# Altium schematic sheet 10_DDR2.SchDoc: RAM DDR2
size A3; Organization: Lime Microsystems; Address1: Surrey Tech Centre; Address2: Guildford GU2 7YG; Address3: Surray; Address4: United Kingdom; Revision: v1.2; SheetNumber: 10; SheetTotal: 14
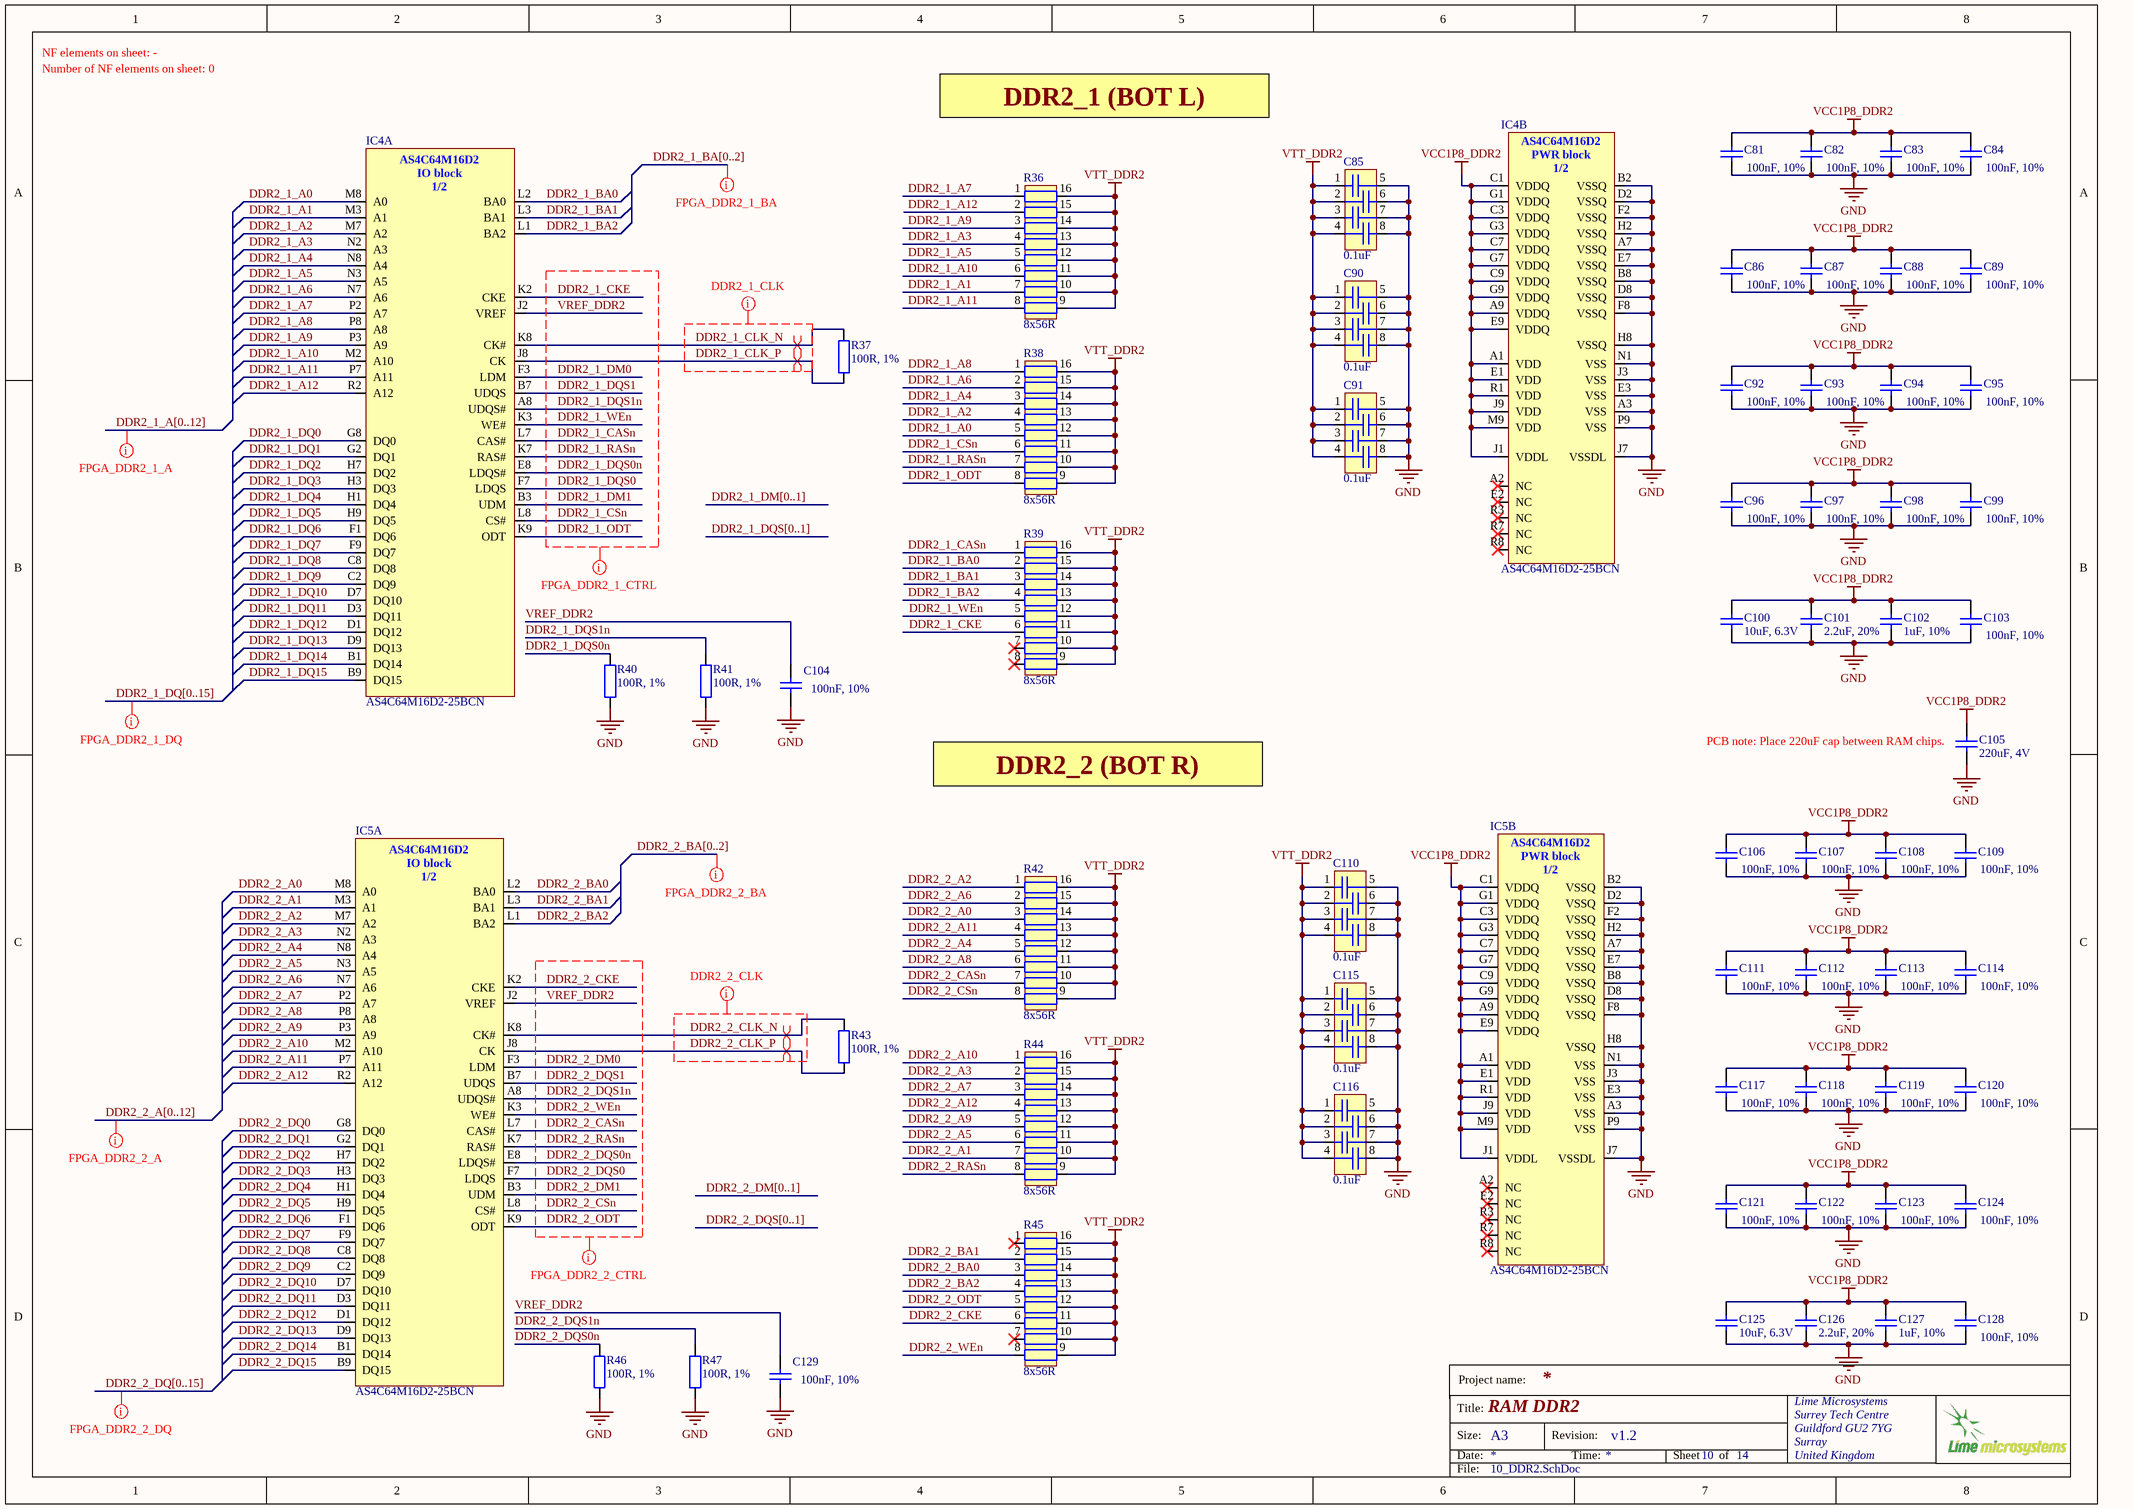
[diagram p0: 10_DDR2.SchDoc]

## Parts
C81  100nF, 10%  [CAP0402]
C82  100nF, 10%  [CAP0402]
C83  100nF, 10%  [CAP0402]
C84  100nF, 10%  [CAP0402]
C85  0.1uF  [CKCA43X7R1C104M100AA]
C86  100nF, 10%  [CAP0402]
C87  100nF, 10%  [CAP0402]
C88  100nF, 10%  [CAP0402]
C89  100nF, 10%  [CAP0402]
C90  0.1uF  [CKCA43X7R1C104M100AA]
C91  0.1uF  [CKCA43X7R1C104M100AA]
C92  100nF, 10%  [CAP0402]
C93  100nF, 10%  [CAP0402]
C94  100nF, 10%  [CAP0402]
C95  100nF, 10%  [CAP0402]
C96  100nF, 10%  [CAP0402]
C97  100nF, 10%  [CAP0402]
C98  100nF, 10%  [CAP0402]
C99  100nF, 10%  [CAP0402]
C100  10uF, 6.3V  [CAP0603]
C101  2.2uF, 20%  [CAP0402]
C102  1uF, 10%  [CAP0402]
C103  100nF, 10%  [CAP0402]
C104  100nF, 10%  [CAP0402]
C105  220uF, 4V  [CAP1206]
C106  100nF, 10%  [CAP0402]
C107  100nF, 10%  [CAP0402]
C108  100nF, 10%  [CAP0402]
C109  100nF, 10%  [CAP0402]
C110  0.1uF  [CKCA43X7R1C104M100AA]
C111  100nF, 10%  [CAP0402]
C112  100nF, 10%  [CAP0402]
C113  100nF, 10%  [CAP0402]
C114  100nF, 10%  [CAP0402]
C115  0.1uF  [CKCA43X7R1C104M100AA]
C116  0.1uF  [CKCA43X7R1C104M100AA]
C117  100nF, 10%  [CAP0402]
C118  100nF, 10%  [CAP0402]
C119  100nF, 10%  [CAP0402]
C120  100nF, 10%  [CAP0402]
C121  100nF, 10%  [CAP0402]
C122  100nF, 10%  [CAP0402]
C123  100nF, 10%  [CAP0402]
C124  100nF, 10%  [CAP0402]
C125  10uF, 6.3V  [CAP0603]
C126  2.2uF, 20%  [CAP0402]
C127  1uF, 10%  [CAP0402]
C128  100nF, 10%  [CAP0402]
C129  100nF, 10%  [CAP0402]
IC4  AS4C64M16D2-25BCN  [AS4C64M16D2]  (parts A,B of 2)
IC5  AS4C64M16D2-25BCN  [AS4C64M16D2]  (parts A,B of 2)
R36  8x56R  [EXB2HV]
R37  100R, 1%  [RES0402]
R38  8x56R  [EXB2HV]
R39  8x56R  [EXB2HV]
R40  100R, 1%  [RES0402]
R41  100R, 1%  [RES0402]
R42  8x56R  [EXB2HV]
R43  100R, 1%  [RES0402]
R44  8x56R  [EXB2HV]
R45  8x56R  [EXB2HV]
R46  100R, 1%  [RES0402]
R47  100R, 1%  [RES0402]

## Nets
GND: C81.2 C82.2 C83.2 C84.2 C85.5 C85.6 C85.7 C85.8 C86.2 C87.2 C88.2 C89.2 C90.5 C90.6 C90.7 C90.8 C91.5 C91.6 C91.7 C91.8 C92.2 C93.2 C94.2 C95.2 C96.2 C97.2 C98.2 C99.2 C100.1 C101.1 C102.1 C103.2 C104.2 C105.1 C106.2 C107.2 C108.2 C109.2 C110.5 C110.6 C110.7 C110.8 C111.2 C112.2 C113.2 C114.2 C115.5 C115.6 C115.7 C115.8 C116.5 C116.6 C116.7 C116.8 C117.2 C118.2 C119.2 C120.2 C121.2 C122.2 C123.2 C124.2 C125.1 C126.1 C127.1 C128.2 C129.2 IC4.A3(VSS) IC4.A7(VSSQ) IC4.B2(VSSQ) IC4.B8(VSSQ) IC4.D2(VSSQ) IC4.D8(VSSQ) IC4.E3(VSS) IC4.E7(VSSQ) IC4.F2(VSSQ) IC4.F8(VSSQ) IC4.H2(VSSQ) IC4.H8(VSSQ) IC4.J3(VSS) IC4.J7(VSSDL) IC4.N1(VSS) IC4.P9(VSS) IC5.A3(VSS) IC5.A7(VSSQ) IC5.B2(VSSQ) IC5.B8(VSSQ) IC5.D2(VSSQ) IC5.D8(VSSQ) IC5.E3(VSS) IC5.E7(VSSQ) IC5.F2(VSSQ) IC5.F8(VSSQ) IC5.H2(VSSQ) IC5.H8(VSSQ) IC5.J3(VSS) IC5.J7(VSSDL) IC5.N1(VSS) IC5.P9(VSS) R40.1 R41.1 R46.1 R47.1
VCC1P8_DDR2: C81.1 C82.1 C83.1 C84.1 C86.1 C87.1 C88.1 C89.1 C92.1 C93.1 C94.1 C95.1 C96.1 C97.1 C98.1 C99.1 C100.2 C101.2 C102.2 C103.1 C105.2 C106.1 C107.1 C108.1 C109.1 C111.1 C112.1 C113.1 C114.1 C117.1 C118.1 C119.1 C120.1 C121.1 C122.1 C123.1 C124.1 C125.2 C126.2 C127.2 C128.1 IC4.A1(VDD) IC4.A9(VDDQ) IC4.C1(VDDQ) IC4.C3(VDDQ) IC4.C7(VDDQ) IC4.C9(VDDQ) IC4.E1(VDD) IC4.E9(VDDQ) IC4.G1(VDDQ) IC4.G3(VDDQ) IC4.G7(VDDQ) IC4.G9(VDDQ) IC4.J1(VDDL) IC4.J9(VDD) IC4.M9(VDD) IC4.R1(VDD) IC5.A1(VDD) IC5.A9(VDDQ) IC5.C1(VDDQ) IC5.C3(VDDQ) IC5.C7(VDDQ) IC5.C9(VDDQ) IC5.E1(VDD) IC5.E9(VDDQ) IC5.G1(VDDQ) IC5.G3(VDDQ) IC5.G7(VDDQ) IC5.G9(VDDQ) IC5.J1(VDDL) IC5.J9(VDD) IC5.M9(VDD) IC5.R1(VDD)
VTT_DDR2: C85.1 C85.2 C85.3 C85.4 C90.1 C90.2 C90.3 C90.4 C91.1 C91.2 C91.3 C91.4 C110.1 C110.2 C110.3 C110.4 C115.1 C115.2 C115.3 C115.4 C116.1 C116.2 C116.3 C116.4 R36.9 R36.10 R36.11 R36.12 R36.13 R36.14 R36.15 R36.16 R38.9 R38.10 R38.11 R38.12 R38.13 R38.14 R38.15 R38.16 R39.9 R39.10 R39.11 R39.12 R39.13 R39.14 R39.15 R39.16 R42.9 R42.10 R42.11 R42.12 R42.13 R42.14 R42.15 R42.16 R44.9 R44.10 R44.11 R44.12 R44.13 R44.14 R44.15 R44.16 R45.9 R45.10 R45.11 R45.12 R45.13 R45.14 R45.15 R45.16
DDR2_1_A0: IC4.M8(A0) R38.5
DDR2_1_A1: IC4.M3(A1) R36.7
DDR2_1_A2: IC4.M7(A2) R38.4
DDR2_1_A3: IC4.N2(A3) R36.4
DDR2_1_A4: IC4.N8(A4) R38.3
DDR2_1_A5: IC4.N3(A5) R36.5
DDR2_1_A6: IC4.N7(A6) R38.2
DDR2_1_A7: IC4.P2(A7) R36.1
DDR2_1_A8: IC4.P8(A8) R38.1
DDR2_1_A9: IC4.P3(A9) R36.3
DDR2_1_A10: IC4.M2(A10) R36.6
DDR2_1_A11: IC4.P7(A11) R36.8
DDR2_1_A12: IC4.R2(A12) R36.2
DDR2_1_BA0: IC4.L2(BA0) R39.2
DDR2_1_BA1: IC4.L3(BA1) R39.3
DDR2_1_BA2: IC4.L1(BA2) R39.4
DDR2_1_CASn: IC4.L7(CAS#) R39.1
DDR2_1_CKE: IC4.K2(CKE) R39.6
DDR2_1_CLK_N: IC4.K8(CK#) R37.2
DDR2_1_CLK_P: IC4.J8(CK) R37.1
DDR2_1_CSn: IC4.L8(CS#) R38.6
DDR2_1_DM0: IC4.F3(LDM)
DDR2_1_DM1: IC4.B3(UDM)
DDR2_1_DQ0: IC4.G8(DQ0)
DDR2_1_DQ1: IC4.G2(DQ1)
DDR2_1_DQ2: IC4.H7(DQ2)
DDR2_1_DQ3: IC4.H3(DQ3)
DDR2_1_DQ4: IC4.H1(DQ4)
DDR2_1_DQ5: IC4.H9(DQ5)
DDR2_1_DQ6: IC4.F1(DQ6)
DDR2_1_DQ7: IC4.F9(DQ7)
DDR2_1_DQ8: IC4.C8(DQ8)
DDR2_1_DQ9: IC4.C2(DQ9)
DDR2_1_DQ10: IC4.D7(DQ10)
DDR2_1_DQ11: IC4.D3(DQ11)
DDR2_1_DQ12: IC4.D1(DQ12)
DDR2_1_DQ13: IC4.D9(DQ13)
DDR2_1_DQ14: IC4.B1(DQ14)
DDR2_1_DQ15: IC4.B9(DQ15)
DDR2_1_DQS0: IC4.F7(LDQS)
DDR2_1_DQS0n: IC4.E8(LDQS#) R40.2
DDR2_1_DQS1: IC4.B7(UDQS)
DDR2_1_DQS1n: IC4.A8(UDQS#) R41.2
DDR2_1_ODT: IC4.K9(ODT) R38.8
DDR2_1_RASn: IC4.K7(RAS#) R38.7
DDR2_1_WEn: IC4.K3(WE#) R39.5
DDR2_2_A0: IC5.M8(A0) R42.3
DDR2_2_A1: IC5.M3(A1) R44.7
DDR2_2_A2: IC5.M7(A2) R42.1
DDR2_2_A3: IC5.N2(A3) R44.2
DDR2_2_A4: IC5.N8(A4) R42.5
DDR2_2_A5: IC5.N3(A5) R44.6
DDR2_2_A6: IC5.N7(A6) R42.2
DDR2_2_A7: IC5.P2(A7) R44.3
DDR2_2_A8: IC5.P8(A8) R42.6
DDR2_2_A9: IC5.P3(A9) R44.5
DDR2_2_A10: IC5.M2(A10) R44.1
DDR2_2_A11: IC5.P7(A11) R42.4
DDR2_2_A12: IC5.R2(A12) R44.4
DDR2_2_BA0: IC5.L2(BA0) R45.3
DDR2_2_BA1: IC5.L3(BA1) R45.2
DDR2_2_BA2: IC5.L1(BA2) R45.4
DDR2_2_CASn: IC5.L7(CAS#) R42.7
DDR2_2_CKE: IC5.K2(CKE) R45.6
DDR2_2_CLK_N: IC5.K8(CK#) R43.2
DDR2_2_CLK_P: IC5.J8(CK) R43.1
DDR2_2_CSn: IC5.L8(CS#) R42.8
DDR2_2_DM0: IC5.F3(LDM)
DDR2_2_DM1: IC5.B3(UDM)
DDR2_2_DQ0: IC5.G8(DQ0)
DDR2_2_DQ1: IC5.G2(DQ1)
DDR2_2_DQ2: IC5.H7(DQ2)
DDR2_2_DQ3: IC5.H3(DQ3)
DDR2_2_DQ4: IC5.H1(DQ4)
DDR2_2_DQ5: IC5.H9(DQ5)
DDR2_2_DQ6: IC5.F1(DQ6)
DDR2_2_DQ7: IC5.F9(DQ7)
DDR2_2_DQ8: IC5.C8(DQ8)
DDR2_2_DQ9: IC5.C2(DQ9)
DDR2_2_DQ10: IC5.D7(DQ10)
DDR2_2_DQ11: IC5.D3(DQ11)
DDR2_2_DQ12: IC5.D1(DQ12)
DDR2_2_DQ13: IC5.D9(DQ13)
DDR2_2_DQ14: IC5.B1(DQ14)
DDR2_2_DQ15: IC5.B9(DQ15)
DDR2_2_DQS0: IC5.F7(LDQS)
DDR2_2_DQS0n: IC5.E8(LDQS#) R46.2
DDR2_2_DQS1: IC5.B7(UDQS)
DDR2_2_DQS1n: IC5.A8(UDQS#) R47.2
DDR2_2_ODT: IC5.K9(ODT) R45.5
DDR2_2_RASn: IC5.K7(RAS#) R44.8
DDR2_2_WEn: IC5.K3(WE#) R45.8
VREF_DDR2: C104.1 C129.1 IC4.J2(VREF) IC5.J2(VREF)

Not connected (* = marked no-connect by the designer): IC4 A2(NC)* E2(NC)* R3(NC)* R7(NC)* R8(NC)*; IC5 A2(NC)* E2(NC)* R3(NC)* R7(NC)* R8(NC)*; R39 7* 8*; R45 1* 7*

## Buses and harness runs
bus DDR2_1_A[0..12]
bus DDR2_1_BA[0..2]
bus DDR2_1_DM[0..1]
bus DDR2_1_DQ[0..15]
bus DDR2_1_DQS[0..1]
bus DDR2_2_A[0..12]
bus DDR2_2_BA[0..2]
bus DDR2_2_DM[0..1]
bus DDR2_2_DQ[0..15]
bus DDR2_2_DQS[0..1]

## Layout directives
net class FPGA_DDR0_DQ: (no net found under the mark)
net class FPGA_DDR0_BA: (no net found under the mark)
net class FPGA_DDR0_CTRL: DDR2_1_CASn, DDR2_1_CKE, DDR2_1_CSn, DDR2_1_DM0, DDR2_1_DM1, DDR2_1_DQS0, DDR2_1_DQS0n, DDR2_1_DQS1, DDR2_1_DQS1n, DDR2_1_ODT, DDR2_1_RASn, DDR2_1_WEn, VREF_DDR2
net class FPGA_DDR0_A: (no net found under the mark)
net class FPGA_DDR1_DQ: (no net found under the mark)
net class FPGA_DDR1_BA: (no net found under the mark)
net class FPGA_DDR1_CTRL: DDR2_2_CASn, DDR2_2_CKE, DDR2_2_CSn, DDR2_2_DM0, DDR2_2_DM1, DDR2_2_DQS0, DDR2_2_DQS0n, DDR2_2_DQS1, DDR2_2_DQS1n, DDR2_2_ODT, DDR2_2_RASn, DDR2_2_WEn, VREF_DDR2
net class FPGA_DDR1_A: (no net found under the mark)
differential pair: DDR2_1_CLK_N, DDR2_1_CLK_P, DDR2_2_CLK_N, DDR2_2_CLK_P
net class DDR2_1_CK: DDR2_1_CLK_N, DDR2_1_CLK_P, DDR2_2_CLK_N, DDR2_2_CLK_P

## Notes on the sheet
- Number of NF elements on sheet: 0
- NF elements on sheet: -
- DDR2_1 (BOT L)
- DDR2_2 (BOT R)
- (near C105) PCB note: Place 220uF cap between RAM chips.
- Project name:
- Title:
- Size:
- Date:
- A3
- Revision:
- Time:
- Sheet
- of
- File:
- (in symbol AS4C64M16D2-25BCN, part A) AS4C64M16D2 / IO block / 1/2
- (in symbol AS4C64M16D2-25BCN, part B) AS4C64M16D2 / PWR block / 1/2

## Library data of the parts
C81-C84 C86-C89 C92-C99 C103 C104 C106-C109 C111-C114 C117-C124 C128 C129 = Cap_0603: Manufacturer Part Number 1: GRM155R71C104KA88D; Part Description: 0.10µF ±10% 16V X7R Ceramic Capacitor -55°C ~ 125°C Surface Mount, MLCC 0402 (1005 Metric) 0.039" L x 0.020" W (1.00mm x 0.50mm); Brand: Murata Electronics; Type: General Purpose MLCC; Capacitance: 0.1 uF; Temperature Coefficient / Code: +/- 15 %; Voltage Rating DC: 16 V; Supplier 1: Mouser; Supplier Part Number 1: 81-GRM155R71C104KA88; Tolerance: 10 %; Case Code - in: 0402; Manufacturer: Murata Electronics; Category: Multilayer Ceramic Capacitors MLCC - SMD/SMT; Value: 100nF, 10%; Manufacturer Part Number: GRM155R71C104KA88D
C85 C90 C91 C110 C115 C116 = 4X_cap_array_1206: Manufacturer: TDK; Part Description: CAP ARRAY 0.1UF 16V X7R 1206; Case Height: 1 mm; Case Length: 3.2 mm; Case Width: 1.6 mm; Voltage Rating: 16 V; Number of Elements: 4; Tolerance: 20 %; Temperature Coefficient / Code: X7R; Value: 0.1uF; Supplier 1: Mouser; Supplier Part Number 1: 810-CKCA43X7R1C104M; RoHS: RoHS Compliant; Termination Style: SMD/SMT; Brand: TDK; Category: Capacitor Arrays & Networks; Product: Ceramic Capacitor Arrays; Series: CKC; Packaging: Reel; Operating Temperature Range: - 55 C to + 125 C; Manufacturer Part Number 1: CKCA43X7R1C104M100AA; Capacitance: 0.1 uF; Product Category: Capacitor Arrays; Standard Pack Qty: 2000; RoHS - Mouser: Y; Minimum Order Quantity: 1; Reeling: True
C100 C125 = Cap_0603: Manufacturer Part Number 1: CC0603MRX5R5BB106; Part Description: 10µF ±20% 6.3V X5R Ceramic Capacitor -55°C ~ 85°C Surface Mount, MLCC 0603 (1608 Metric) 0.063" L x 0.031" W (1.60mm x 0.80mm); Manufacturer: Yageo; Capacitance: 10µF; Tolerance: ±20%; Supplier 1: Digi-Key; Supplier Part Number 1: 311-1448-2-ND; Package / Case: 0603 (1608 Metric); Category: Capacitors; Voltage - Rated: 6.3V; Value: 10uF, 6.3V
C101 C126 = Cap_0402: Manufacturer Part Number 1: C1005X5R1C225K050BC; Manufacturer: TDK Corporation; Part Description: 2.2µF ±10% 16V X5R Ceramic Capacitor -55°C ~ 85°C Surface Mount, MLCC 0402 (1005 Metric) 0.039" L x 0.020" W (1.00mm x 0.50mm); Voltage - Rated: 16V; Temperature Coefficient: X5R; Capacitance: 2.2µF; Value: 2.2uF, 20%; Supplier 1: Digi-Key; Supplier Part Number 1: 445-9085-1-ND; Category: Capacitors; Thickness (Max): 0.022" (0.55mm); Applications: General Purpose; Package / Case: 0402 (1005 Metric); Size / Dimension: 0.039" L x 0.020" W (1.00mm x 0.50mm); Features: -; Mounting Type: Surface Mount, MLCC; Ratings: -; Lead Style: -; Operating Temperature: -55°C ~ 85°C; Lead Spacing: -; RoHS: RoHS Compliant; Height - Seated (Max): -; Tolerance: ±20%; Packaging: Tape & Reel (TR)
C102 C127 = Cap_0402: Manufacturer Part Number 1: GRM155R61A105KE15J; Manufacturer: TDK; Part Description: 1µF ±10% 10V X5R Ceramic Capacitor -55°C ~ 85°C Surface Mount, MLCC 0402 (1005 Metric) 0.039" L x 0.020" W (1.00mm x 0.50mm); Voltage Rating: 10; Product Range: TDK - C Series; Ceramic Capacitor Case: 0402 [1005 Metric]; Capacitance: 1; Dielectric Characteristic: X6; Value: 1uF, 10%; Supplier 1: Newark; Supplier Part Number 1: 490-6298-2-ND; Capacitance Tolerance: ± 10%; MSL: -; RoHS: YES
C105 = Cap_1206: Manufacturer Part Number: GRM31CR60G227ME11L; Manufacturer: Murata Electronics North America; Part Description: 220µF ±20% 4V X5R Ceramic Capacitor -55°C ~ 85°C Surface Mount, MLCC 1206 (3216 Metric) 0.126" L x 0.063" W (3.20mm x 1.60mm); Capacitance: 220µF; Temperature Coefficient: X5R; Tolerance: ±20%; Package / Case: 1206 (3216 Metric); Supplier 1: Digi-Key; Packaging: Cut Tape (CT); Size / Dimension: 0.126" L x 0.063" W (3.20mm x 1.60mm); Operating Temperature: -55°C ~ 85°C; Voltage - Rated: 4V; Mounting Type: Surface Mount, MLCC; Ratings: -; Supplier Part Number 1: 490-9774-1-ND; Category: Capacitors; Lead Spacing: -; Lead Style: -; Applications: General Purpose; Features: -; Height - Seated (Max): -; Thickness (Max): 0.075" (1.90mm); RoHS: RoHS Compliant; Value: 220uF, 4V
IC4 IC5 = AS4C64M16D2-25BCN: Manufacturer: Alliance Memory, Inc.; Part Description: IC SDRAM 64MX16 1.8V 84-FBGA; Speed: 400MHz; Interface: Parallel; Memory Type: DDR2 SDRAM; Memory Size: 1G (64M x 16); Voltage - Supply: 1.7 V ~ 1.9 V; Format - Memory: RAM; Supplier 1: Digi-Key; Package / Case: 84-TFBGA; Supplier Device Package: 84-FBGA (8x12.5); Manufacturer Part Number 1: AS4C64M16D2-25BCN; RoHS: RoHS Compliant; Operating Temperature: 0°C ~ 70°C; Category: Integrated Circuits (ICs); Packaging: Tray; Supplier Part Number 1: 1450-1158-ND
R36 R38 R39 R42 R44 R45 = 8X_resistor_array_0402: Manufacturer Part Number 1: EXB2HV560JV; Manufacturer: PANASONIC ELECTRONIC COMPONENTS; Part Description: RES ARRAY 8 RES 56 OHM 1506; Supplier 1: Farnell; Supplier Part Number 1: 2060070; RoHS: YES
R37 R40 R41 R43 R46 R47 = Res_0402: Manufacturer Part Number 1: RMCF0402FT100R; Part Description: RES SMD 100 OHM 1% 1/16W 0402; Temperature Coefficient: ±100ppm/°C; Supplier 1: Digi-Key; Supplier Part Number 1: RMCF0402FT100RDKR-ND; Package / Case: 0402 (1005 Metric); Composition: Thick Film; Category: Resistors; Tolerance: ±1%; Value: 100R, 1%